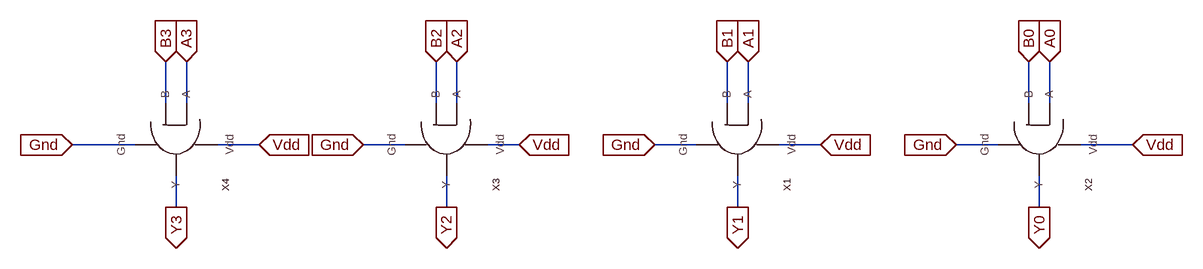
[diagram p0: schematic ALU_OR.asc]
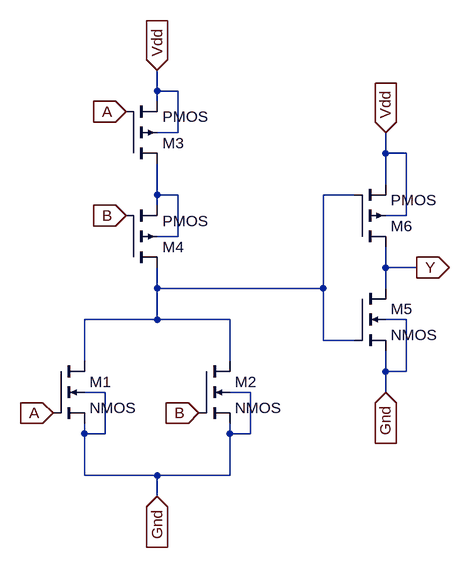
[diagram p1: sub-circuit or.asc]
ALU_OR.asc, the LTspice schematic file:
Version 4
SHEET 1 1160 680
WIRE -432 128 -432 64
WIRE -400 128 -400 64
WIRE -16 128 -16 64
WIRE 16 128 16 64
WIRE 432 128 432 64
WIRE 464 128 464 64
WIRE 896 128 896 64
WIRE 928 128 928 64
WIRE -480 192 -576 192
WIRE -288 192 -352 192
WIRE -64 192 -128 192
WIRE 112 192 64 192
WIRE 384 192 320 192
WIRE 576 192 512 192
WIRE 848 192 784 192
WIRE 1056 192 976 192
WIRE -416 288 -416 240
WIRE 0 288 0 240
WIRE 448 288 448 240
WIRE 912 288 912 240
FLAG -400 64 A3
IOPIN -400 64 In
FLAG -432 64 B3
IOPIN -432 64 In
FLAG -16 64 B2
IOPIN -16 64 In
FLAG 16 64 A2
IOPIN 16 64 In
FLAG 432 64 B1
IOPIN 432 64 In
FLAG 464 64 A1
IOPIN 464 64 In
FLAG 896 64 B0
IOPIN 896 64 In
FLAG 928 64 A0
IOPIN 928 64 In
FLAG 784 192 Gnd
IOPIN 784 192 In
FLAG 320 192 Gnd
IOPIN 320 192 In
FLAG -128 192 Gnd
IOPIN -128 192 In
FLAG -576 192 Gnd
IOPIN -576 192 In
FLAG -416 288 Y3
IOPIN -416 288 Out
FLAG -288 192 Vdd
IOPIN -288 192 In
FLAG 0 288 Y2
IOPIN 0 288 Out
FLAG 112 192 Vdd
IOPIN 112 192 In
FLAG 448 288 Y1
IOPIN 448 288 Out
FLAG 576 192 Vdd
IOPIN 576 192 In
FLAG 912 288 Y0
IOPIN 912 288 Out
FLAG 1056 192 Vdd
IOPIN 1056 192 In
SYMBOL OR 480 192 R90
SYMATTR InstName X1
SYMBOL OR 944 192 R90
SYMATTR InstName X2
SYMBOL OR 32 192 R90
SYMATTR InstName X3
SYMBOL OR -384 192 R90
SYMATTR InstName X4

or.asc, the sub-circuit schematic file:
Version 4
SHEET 1 880 680
WIRE 272 -416 272 -448
WIRE 304 -416 272 -416
WIRE 272 -400 272 -416
WIRE 304 -352 304 -416
WIRE 304 -352 272 -352
WIRE 624 -320 624 -352
WIRE 656 -320 624 -320
WIRE 624 -272 624 -320
WIRE 272 -256 272 -304
WIRE 304 -256 272 -256
WIRE 576 -256 528 -256
WIRE 272 -240 272 -256
WIRE 656 -224 656 -320
WIRE 656 -224 624 -224
WIRE 304 -192 304 -256
WIRE 304 -192 272 -192
WIRE 624 -144 624 -176
WIRE 672 -144 624 -144
WIRE 272 -112 272 -144
WIRE 528 -112 528 -256
WIRE 528 -112 272 -112
WIRE 624 -112 624 -144
WIRE 272 -64 272 -112
WIRE 272 -64 160 -64
WIRE 384 -64 272 -64
WIRE 656 -64 624 -64
WIRE 528 -32 528 -112
WIRE 576 -32 528 -32
WIRE 160 0 160 -64
WIRE 384 0 384 -64
WIRE 624 16 624 -16
WIRE 656 16 656 -64
WIRE 656 16 624 16
WIRE 192 48 160 48
WIRE 416 48 384 48
WIRE 624 48 624 16
WIRE 160 112 160 96
WIRE 192 112 192 48
WIRE 192 112 160 112
WIRE 384 112 384 96
WIRE 416 112 416 48
WIRE 416 112 384 112
WIRE 160 176 160 112
WIRE 272 176 160 176
WIRE 384 176 384 112
WIRE 384 176 272 176
WIRE 272 208 272 176
FLAG 272 -448 Vdd
IOPIN 272 -448 In
FLAG 224 -384 A
IOPIN 224 -384 In
FLAG 112 80 A
IOPIN 112 80 In
FLAG 224 -224 B
IOPIN 224 -224 In
FLAG 336 80 B
IOPIN 336 80 In
FLAG 272 208 Gnd
IOPIN 272 208 In
FLAG 624 -352 Vdd
IOPIN 624 -352 In
FLAG 624 48 Gnd
IOPIN 624 48 In
FLAG 672 -144 Y
IOPIN 672 -144 Out
SYMBOL nmos4 112 0 R0
SYMATTR InstName M1
SYMBOL nmos4 336 0 R0
SYMATTR InstName M2
SYMBOL pmos4 224 -304 M180
SYMATTR InstName M3
SYMBOL pmos4 224 -144 M180
SYMATTR InstName M4
SYMBOL nmos4 576 -112 R0
SYMATTR InstName M5
SYMBOL pmos4 576 -176 M180
SYMATTR InstName M6

The netlist it stands for:
* ALU_OR.asc
XX1 Vdd Y1 Gnd A1 B1 or
XX2 Vdd Y0 Gnd A0 B0 or
XX3 Vdd Y2 Gnd A2 B2 or
XX4 Vdd Y3 Gnd A3 B3 or

* block symbol definitions
.subckt or Vdd Y Gnd A B
M1 N002 A Gnd Gnd NMOS
M2 N002 B Gnd Gnd NMOS
M3 N001 A Vdd Vdd PMOS
M4 N002 B N001 N001 PMOS
M5 Y N002 Gnd Gnd NMOS
M6 Y N002 Vdd Vdd PMOS
.ends or

.model NMOS NMOS
.model PMOS PMOS
.lib standard.mos
.backanno
.end